# Altium schematic sheet GPS.SchDoc: GPS
size B; CheckedBy: Lance Bantoto; Engineer: Cindy Li; Organization: Altium Limited; Address1: L3, 12a Rodborough Rd; Address2: Frenchs Forest; Address3: NSW; Address4: Australia 2086; Revision: 1; SheetNumber: 5; SheetTotal: 6
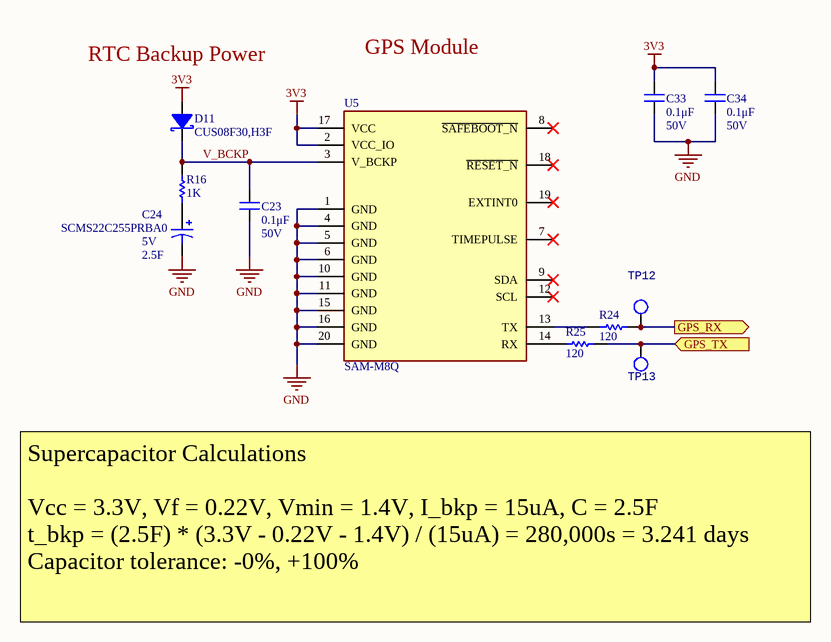
[diagram p0: GPS.SchDoc]

## Parts
C23  value 0.1μF  Voltage Rating: 50V  [CAP2012]  (hidden comment: CAP_0.1uF_50V_0805)
C24  Voltage Rating: 5V  Capacitance: 2.5F  [SCMS22C255PRBA0]  (hidden comment: CAP_2.5F_5V)
C33  value 0.1μF  Voltage Rating: 50V  [CAP2012]  (hidden comment: CAP_0.1uF_50V_0805)
C34  value 0.1μF  Voltage Rating: 50V  [CAP2012]  (hidden comment: CAP_0.1uF_50V_0805)
D11  Manufacturer Part Number 1: CUS08F30,H3F  [SOD-323_UNIDIR]  (hidden comment: DIO_SCHOTTKY_30V_800mA)
R16  value 1K  [RESC0603(1608)_N]  (hidden comment: RES_1K_0603)
R24  value 120  [RESC0603(1608)_N]  (hidden comment: RES_120R_0603)
R25  value 120  [RESC0603(1608)_N]  (hidden comment: RES_120R_0603)
TP12  TESTPOINT_LOOP  [TESTPOINT_LOOP]  (value not drawn)
TP13  TESTPOINT_LOOP  [TESTPOINT_LOOP]  (value not drawn)
U5  SAM-M8Q  [SAM-M8Q]

## Ports
GPS_RX (out), GPS_TX (in)

## Nets
3V3: C33.2 C34.2 D11.1(Anode) U5.2(VCC_IO) U5.17(VCC)
GND: C23.1 C24.2 C33.1 C34.1 U5.1(GND) U5.4(GND) U5.5(GND) U5.6(GND) U5.10(GND) U5.11(GND) U5.15(GND) U5.16(GND) U5.20(GND)
GPS_RX: R24.2 TP12.1 ; port GPS_RX
GPS_TX: R25.2 TP13.1 ; port GPS_TX
V_BCKP: C23.2 D11.2(Cathode) R16.1 U5.3(V_BCKP)
NetC24_1: C24.1 R16.2
NetR24_1: R24.1 U5.13(TX)
NetR25_1: R25.1 U5.14(RX)

Not connected (* = marked no-connect by the designer): U5 7(TIMEPULSE)* 8(~{SAFEBOOT_N})* 9(SDA)* 12(SCL)* 18(~{RESET_N})* 19(EXTINT0)*

## Notes on the sheet
- (near D11) RTC Backup Power
- GPS Module
- Supercapacitor Calculations
  Vcc = 3.3V, Vf = 0.22V, Vmin = 1.4V, I_bkp = 15uA, C = 2.5F
  t_bkp = (2.5F) * (3.3V - 0.22V - 1.4V) / (15uA) = 280,000s = 3.241 days
  Capacitor tolerance: -0%, +100%
- Title:
- Project:
- Date:
- Rev:
- Checker:
- Engineer:
- Sheet:
- of

## Library data of the parts
C23 C33 C34 = CAP_0.1uF_50V_0805: CAP CER 0.1UF 50V X7R 0805; Manufacturer 1: Murata Electronics; Manufacturer Part Number 1: GCD21BR71H104KA01L; Tolerance: 10%; Mount: Surface Mount; Case Code (Metric): 2012; Case Code (Imperial): 0805; Min Operating Temperature: -55°C; Max Operating Temperature: 125°C; Dielectric: X7R; Termination: SMD/SMT; Length: 2mm; Height: 1.25mm; Width: 0.049inch; Thickness: 0.049inch; Depth: 1.25mm; Ratings: AEC-Q200; Supplier 1: Digi-Key; Supplier Part Number 1: 490-11955-1-ND; Package: 0805 (2012 Metric)
C24 = CAP_2.5F_5V: CAP 2.5F 5V; Manufacturer 1: AVX Corporation; Tolerance: 0%, +100%; Manufacturer Part Number 1: SCMS22C255PRBA0; RoHS: Yes; Mount: Through Hole; Case/Package: Radial; Min Operating Temperature: -40°C; Max Operating Temperature: 85°C; Voltage Rating (DC): 5V; Dimensions: 0.787" L x 0.394" W (20.00mm x 10.00mm); Height - Seated (Max): 0.925" (23.50mm); Supplier 1: Digi-Key
D11 = DIO_SCHOTTKY_30V_800mA: DIODE SCHOTTKY 30V 800MA USC; Manufacturer 1: Toshiba Semiconductor and Storage; Vf (Max): 220mV; Supplier 1: Digi-Key; Supplier Part Number 1: CUS08F30H3FCT-ND; Mount: Surface Mount; Vr (Max): 30V; Io: 800mA
R16 = RES_1K_0603: RES SMD 1K OHM 5% 1/10W 0603; Manufacturer 1: Yageo; Manufacturer Part Number 1: RC0603JR-071KL; Dimensions: 0.063" L x 0.031" W (1.60mm x 0.80mm); Tolerance: 5%; Package: 0603 (1608 Metric); Supplier Part Number 1: 311-1.0KGRCT-ND; Supplier 1: Digi-Key; Mount: Surface Mount
R24 R25 = RES_120R_0603: RES SMD 120 OHM 5% 1/10W 0603; Manufacturer 1: Yageo; Manufacturer Part Number 1: RC0603JR-07120RL; Package: 0603 (1608 Metric); Dimensions: 0.063" L x 0.031" W (1.60mm x 0.80mm); Tolerance: 5%; Supplier Part Number 1: 311-120GRCT-ND; Supplier 1: Digi-Key; Mount: Surface Mount
TP12 TP13 = TESTPOINT_LOOP: PC TEST POINT MINIATURE WHITE; Manufacturer Part Number 1: 5002; Manufacturer 1: Keystone Electronics; Supplier Part Number 1: 36-5002-ND; Supplier 1: Digi-Key; Mount: Through Hole
U5 = SAM-M8Q: Rf Rx Galileo 1.575GHZ/1.602GHZ; Manufacturer 1: u-blox; Manufacturing Part Number 1: SAM-M8Q-0-10; Interface: I2C,SPI,USB,UART; Sensitivity: -165dBm; Data Rate: 400Kbps; Supplier 1: Digi-Key; Case/Package: SMD/SMT; Min Operating Temperature: -40°C; Max Operating Temperature: 85°C; Frequency: 1.602GHz; Supplier Part Number 1: 672-1054-1-ND